# Altium schematic sheet BG95-SHEEET.SchDoc
size C; SheetNumber: 1; SheetTotal: 3
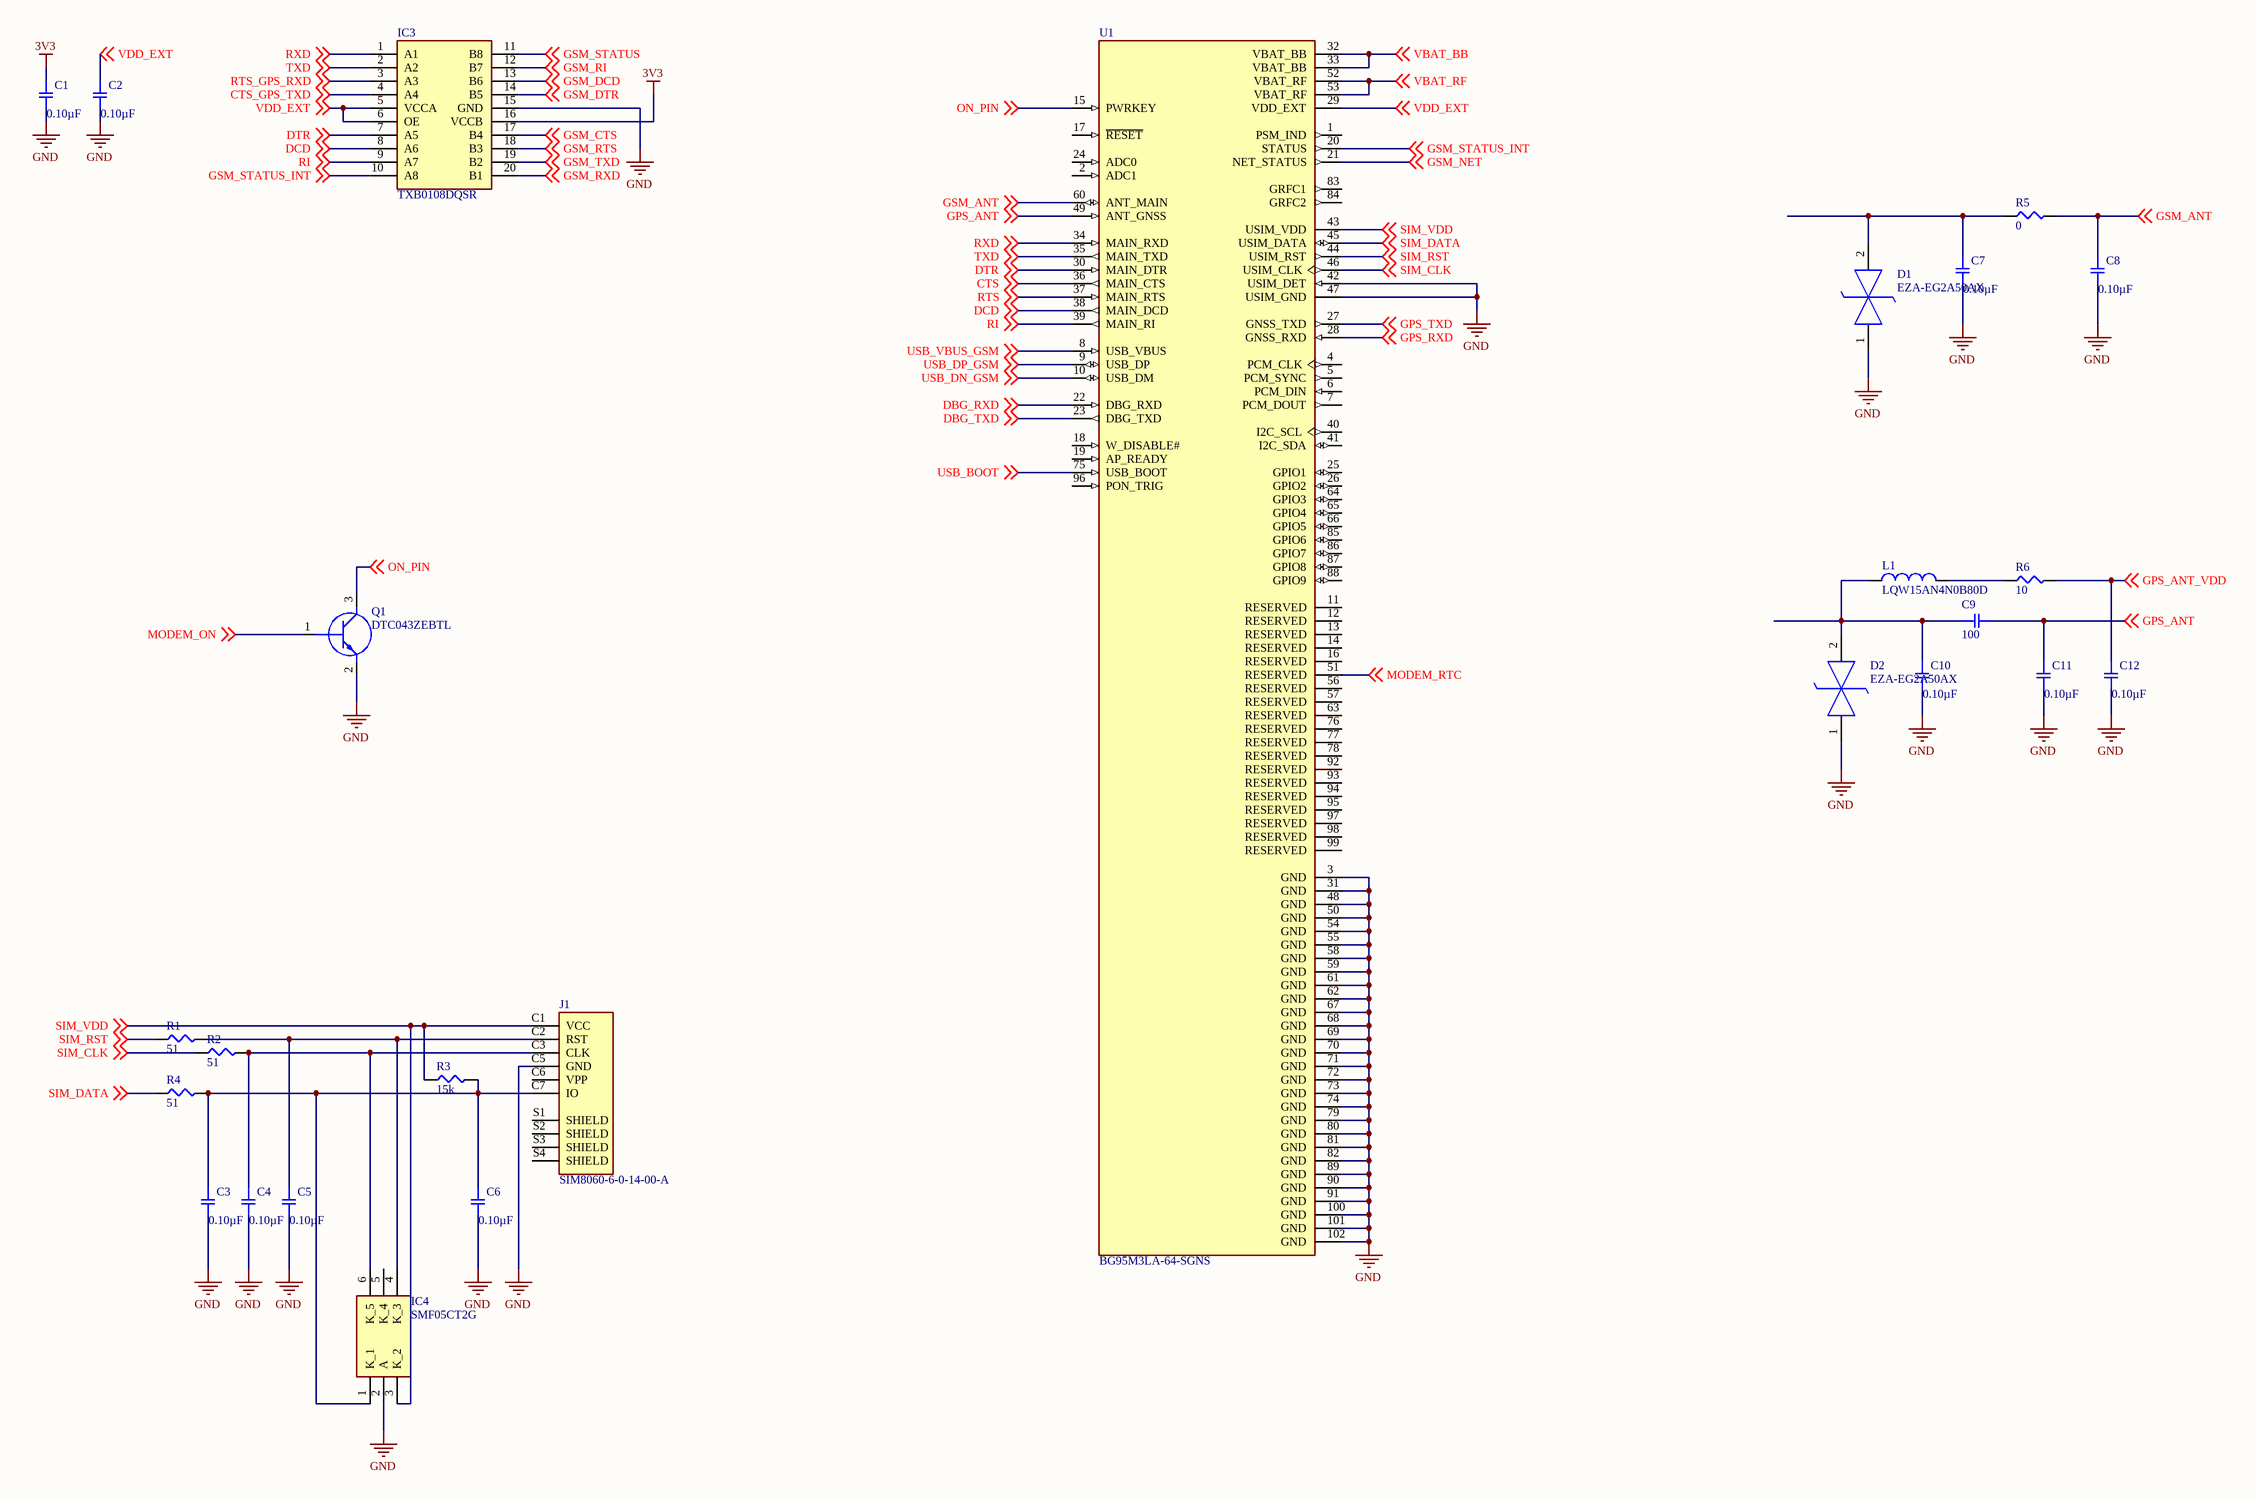
[diagram p0: BG95-SHEEET.SchDoc]

## Parts
C1  0.10µF  [SMD-0402C]
C2  0.10µF  [SMD-0402C]
C3  0.10µF  [SMD-0402C]
C4  0.10µF  [SMD-0402C]
C5  0.10µF  [SMD-0402C]
C6  0.10µF  [SMD-0402C]
C7  0.10µF  [SMD-0402C]
C8  0.10µF  [SMD-0402C]
C9  100  [SMD-0402C]
C10  0.10µF  [SMD-0402C]
C11  0.10µF  [SMD-0402C]
C12  0.10µF  [SMD-0402C]
D1  EZA-EG2A50AX  [EZAEG2A50AX]
D2  EZA-EG2A50AX  [EZAEG2A50AX]
IC3  TXB0108DQSR  [TXB0108DQSR]
IC4  SMF05CT2G  [SOT65P210X110-6N]
J1  SIM8060-6-0-14-00-A  [GCT_SIM8060-6-0-14-00-A]
L1  LQW15AN4N0B80D  [INDC1006X60N]
Q1  DTC043ZEBTL  [SOTFL50P160X85-3N]
R1  51  [SMD-0402-RES]
R2  51  [SMD-0402-RES]
R3  15k  [SMD-0402-RES]
R4  51  [SMD-0402-RES]
R5  0  [SMD-0402-RES]
R6  10  [SMD-0402-RES]
U1  BG95M3LA-64-SGNS  [XCVR_BG95M3LA-64-SGNS]

## Nets
3V3: C1.1 IC3.16(VCCB)
GND: C1.2 C2.2 C3.2 C4.2 C5.2 C6.2 C7.2 C8.2 C10.2 C11.2 C12.2 D1.1(K1) D2.1(K1) IC3.15(GND) IC4.2(A) J1.C5(GND) Q1.2(E) U1.3(GND) U1.31(GND) U1.42(USIM_DET) U1.47(USIM_GND) U1.48(GND) U1.50(GND) U1.54(GND) U1.55(GND) U1.58(GND) U1.59(GND) U1.61(GND) U1.62(GND) U1.67(GND) U1.68(GND) U1.69(GND) U1.70(GND) U1.71(GND) U1.72(GND) U1.73(GND) U1.74(GND) U1.79(GND) U1.80(GND) U1.81(GND) U1.82(GND) U1.89(GND) U1.90(GND) U1.91(GND) U1.100(GND) U1.101(GND) U1.102(GND)
CTS: U1.36(MAIN_CTS) ; off-sheet CTS
CTS_GPS_TXD: IC3.4(A4) ; off-sheet CTS_GPS_TXD
DBG_RXD: U1.22(DBG_RXD) ; off-sheet DBG_RXD
DBG_TXD: U1.23(DBG_TXD) ; off-sheet DBG_TXD
DCD: IC3.8(A6) U1.38(MAIN_DCD) ; off-sheet DCD
DTR: IC3.7(A5) U1.30(MAIN_DTR) ; off-sheet DTR
GPS_ANT: C9.2 C11.1 U1.49(ANT_GNSS) ; off-sheet GPS_ANT
GPS_ANT_VDD: C12.1 R6.2 ; off-sheet GPS_ANT_VDD
GPS_RXD: U1.28(GNSS_RXD) ; off-sheet GPS_RXD
GPS_TXD: U1.27(GNSS_TXD) ; off-sheet GPS_TXD
GSM_ANT: C8.1 R5.2 U1.60(ANT_MAIN) ; off-sheet GSM_ANT
GSM_CTS: IC3.17(B4) ; off-sheet GSM_CTS
GSM_DCD: IC3.13(B6) ; off-sheet GSM_DCD
GSM_DTR: IC3.14(B5) ; off-sheet GSM_DTR
GSM_NET: U1.21(NET_STATUS) ; off-sheet GSM_NET
GSM_RI: IC3.12(B7) ; off-sheet GSM_RI
GSM_RTS: IC3.18(B3) ; off-sheet GSM_RTS
GSM_RXD: IC3.20(B1) ; off-sheet GSM_RXD
GSM_STATUS: IC3.11(B8) ; off-sheet GSM_STATUS
GSM_STATUS_INT: IC3.10(A8) U1.20(STATUS) ; off-sheet GSM_STATUS_INT
GSM_TXD: IC3.19(B2) ; off-sheet GSM_TXD
MODEM_ON: Q1.1(B) ; off-sheet MODEM_ON
MODEM_RTC: U1.51(RESERVED) ; off-sheet MODEM_RTC
ON_PIN: Q1.3(C) U1.15(PWRKEY) ; off-sheet ON_PIN
RI: IC3.9(A7) U1.39(MAIN_RI) ; off-sheet RI
RTS: U1.37(MAIN_RTS) ; off-sheet RTS
RTS_GPS_RXD: IC3.3(A3) ; off-sheet RTS_GPS_RXD
RXD: IC3.1(A1) U1.34(MAIN_RXD) ; off-sheet RXD
SIM_CLK: R2.1 U1.46(USIM_CLK) ; off-sheet SIM_CLK
SIM_DATA: R4.1 U1.45(USIM_DATA) ; off-sheet SIM_DATA
SIM_RST: R1.1 U1.44(USIM_RST) ; off-sheet SIM_RST
SIM_VDD: IC4.3(K_2) J1.C1(VCC) R3.1 U1.43(USIM_VDD) ; off-sheet SIM_VDD
TXD: IC3.2(A2) U1.35(MAIN_TXD) ; off-sheet TXD
USB_BOOT: U1.75(USB_BOOT) ; off-sheet USB_BOOT
USB_DN_GSM: U1.10(USB_DM) ; off-sheet USB_DN_GSM
USB_DP_GSM: U1.9(USB_DP) ; off-sheet USB_DP_GSM
USB_VBUS_GSM: U1.8(USB_VBUS) ; off-sheet USB_VBUS_GSM
VBAT_BB: U1.32(VBAT_BB) U1.33(VBAT_BB) ; off-sheet VBAT_BB
VBAT_RF: U1.52(VBAT_RF) U1.53(VBAT_RF) ; off-sheet VBAT_RF
VDD_EXT: C2.1 IC3.5(VCCA) IC3.6(OE) U1.29(VDD_EXT) ; off-sheet VDD_EXT
NetC3_1: C3.1 C6.1 IC4.1(K_1) J1.C7(IO) R3.2 R4.2
NetC4_1: C4.1 IC4.6(K_5) J1.C3(CLK) R2.2
NetC5_1: C5.1 IC4.4(K_3) J1.C2(RST) R1.2
NetC7_1: C7.1 D1.2(K2) R5.1
NetC9_1: C9.1 C10.1 D2.2(K2) L1.1
NetL1_2: L1.2 R6.1

Not connected (* = marked no-connect by the designer): IC4 5(K_4); J1 C6(VPP) S1(SHIELD) S2(SHIELD) S3(SHIELD) S4(SHIELD); U1 1(PSM_IND) 2(ADC1) 4(PCM_CLK) 5(PCM_SYNC) 6(PCM_DIN) 7(PCM_DOUT) 11(RESERVED) 12(RESERVED) 13(RESERVED) 14(RESERVED) 16(RESERVED) 17(~{RESET}) 18(W_DISABLE#) 19(AP_READY) 24(ADC0) 25(GPIO1) 26(GPIO2) 40(I2C_SCL) 41(I2C_SDA) 56(RESERVED) 57(RESERVED) 63(RESERVED) 64(GPIO3) 65(GPIO4) 66(GPIO5) 76(RESERVED) 77(RESERVED) 78(RESERVED) 83(GRFC1) 84(GRFC2) 85(GPIO6) 86(GPIO7) 87(GPIO8) 88(GPIO9) 92(RESERVED) 93(RESERVED) 94(RESERVED) 95(RESERVED) 96(PON_TRIG) 97(RESERVED) 98(RESERVED) 99(RESERVED)

## Library data of the parts
C1-C8 C10-C12 = GRM152R61A104KE19D: CAP CER 0.1UF 10V X5R 0402; Manufacturer: Murata Electronics North America; Factory Stock: 0; Unit Price (USD): 0.16; Minimum Quantity: 1; Tolerance: ±10%; Datasheets: http://www.murata.com/~/media/webrenewal/support/library/catalog/products/capacitor/mlcc/c02e.pdf; Image: //media.digikey.com/Renders/Murata%20Renders/ZRB-SERIES-0402.jpg; Digi-Key Part Number: 490-10008-1-ND; Part Number: GRM152R61A104KE19D; Quantity Available: 80241; @ qty: 0; Packaging: Cut Tape (CT); Series: GRM; Part Status: Active; Value: 0.10µF; Voltage: 10V; Temperature Coefficient: X5R; Operating Temperature: -55°C ~ 85°C; Features: Derating Recommended; Ratings: -; Applications: General Purpose; Mounting Type: Surface Mount, MLCC; Package / Case: 0402 (1005 Metric); Size / Dimension: 0.039" L x 0.020" W (1.00mm x 0.50mm); Height - Seated (Max): -; Thickness (Max): 0.009" (0.22mm); Lead Spacing: -; Lead Style: -
C9 = GRM152R61A104KE19D: CAP CER 0.1UF 10V X5R 0402; Manufacturer: Murata Electronics North America; Factory Stock: 0; Unit Price (USD): 0.16; Minimum Quantity: 1; Value: 0.10µF; Tolerance: ±10%; Datasheets: http://www.murata.com/~/media/webrenewal/support/library/catalog/products/capacitor/mlcc/c02e.pdf; Image: //media.digikey.com/Renders/Murata%20Renders/ZRB-SERIES-0402.jpg; Digi-Key Part Number: 490-10008-1-ND; Part Number: GRM152R61A104KE19D; Quantity Available: 80241; @ qty: 0; Packaging: Cut Tape (CT); Series: GRM; Part Status: Active; Voltage: 10V; Temperature Coefficient: X5R; Operating Temperature: -55°C ~ 85°C; Features: Derating Recommended; Ratings: -; Applications: General Purpose; Mounting Type: Surface Mount, MLCC; Package / Case: 0402 (1005 Metric); Size / Dimension: 0.039" L x 0.020" W (1.00mm x 0.50mm); Height - Seated (Max): -; Thickness (Max): 0.009" (0.22mm); Lead Spacing: -; Lead Style: -
D1 D2 = EZA-EG2A50AX: Diode ESD (Bi-directional); Manufacturer_Name: Panasonic; Datasheet Link: https://industrial.panasonic.com/cdbs/www-data/pdf/AWD0000/AWD0000C23.pdf; Height: 0.38mm; Manufacturer_Part_Number: EZA-EG2A50AX; Mouser Part Number: 667-EZA-EG2A50AX; Mouser Price/Stock: https://www.mouser.co.uk/ProductDetail/Panasonic/EZA-EG2A50AX?qs=WwqriLBepZuVGjkTEFYPQg%3D%3D; Arrow Part Number: EZA-EG2A50AX; Arrow Price/Stock: https://www.arrow.com/en/products/eza-eg2a50ax/panasonic; Simulation Data: https://industrial.panasonic.com/content/data/CC/files/EZAEG2A50AX.zip
IC3 = TXB0108DQSR: Integrated Circuit; Manufacturer_Name: Texas Instruments; Datasheet Link: http://www.ti.com/lit/gpn/txb0108; Height: 0mm; Manufacturer_Part_Number: TXB0108DQSR; Mouser Part Number: 595-TXB0108DQSR; Mouser Price/Stock: https://www.mouser.co.uk/ProductDetail/Texas-Instruments/TXB0108DQSR?qs=EuM%2FBx4ov4SMZCOlCh%2FWxA%3D%3D; Arrow Part Number: TXB0108DQSR; Arrow Price/Stock: https://www.arrow.com/en/products/txb0108dqsr/texas-instruments?region=nac
IC4 = SMF05CT2G: Integrated Circuit; Manufacturer_Name: onsemi; Datasheet Link: http://www.onsemi.com/pub/Collateral/SMF05C-D.PDF; Height: 1.1mm; Manufacturer_Part_Number: SMF05CT2G; Mouser Part Number: 863-SMF05CT2G; Mouser Price/Stock: https://www.mouser.co.uk/ProductDetail/onsemi/SMF05CT2G?qs=xZq1yRCsb1fkTB9yOMghAg%3D%3D; Arrow Part Number: SMF05CT2G; Arrow Price/Stock: https://www.arrow.com/en/products/smf05ct2g/on-semiconductor?region=nac
J1 = SIM8060-6-0-14-00-A: SIM8060 is a hinged Sim Card Connector. With 6 contacts, with switch for card detection. Profile above PCB is 1.43mm.; MF: {'manufacturer': u'Global Connector Technology'}; Package: None; Price: None; Value: *; MP: SIM8060-6-0-14-00-A; Availability: Unavailable
L1 = LQW15AN4N0B80D: Ind RF Chip Unshielded Wirewound 4nH 0.1nH 100MHz 30Q-Factor 1950mA 0402 Paper T/R; MF: {'manufacturer': u'Murata'}; Package: None; Price: None; Value: *; MP: LQW15AN4N0B80D; Availability: Unavailable
Q1 = DTC043ZEBTL: Transistor BJT NPN; Manufacturer_Name: ROHM Semiconductor; Datasheet Link: http://rohmfs.rohm.com/en/products/databook/datasheet/discrete/transistor/digital/dtc043zmt2l-e.pdf; Height: 0.85mm; Manufacturer_Part_Number: DTC043ZEBTL; Mouser Part Number: 755-DTC043ZEBTL; Mouser Price/Stock: https://www.mouser.co.uk/ProductDetail/ROHM-Semiconductor/DTC043ZEBTL?qs=n7vHx8wJlDGyWrBOh0icRQ%3D%3D
R1 R2 R4 = ERJ-2GEJ510X: RES SMD 51 OHM 5% 1/10W 0402; Manufacturer: Panasonic Electronic Components; Factory Stock: 0; Unit Price (USD): 0.00350; @ qty: 1500; Minimum Quantity: 1; Power (Watts): 0.1W, 1/10W; Temperature Coefficient: ±200ppm/°C; Part Number: ERJ-2GEJ510X; Datasheets: http://industrial.panasonic.com/www-cgi/jvcr13pz.cgi?E+PZ+3+AOA0001+ERJ2GEJ510X+7+WW; Image: //media.digikey.com/Photos/Panasonic%20Photos/ERJ-PA2-Series.jpg; Digi-Key Part Number: P51JCT-ND; Quantity Available: 159188; Packaging: Cut Tape (CT); Series: ERJ; Part Status: Active; Value: 51; Tolerance: ±5%; Composition: Thick Film; Features: Automotive AEC-Q200; Operating Temperature: -55°C ~ 155°C; Package / Case: 0402 (1005 Metric); Supplier Device Package: 0402; Size / Dimension: 0.039" L x 0.020" W (1.00mm x 0.50mm); Height - Seated (Max): 0.016" (0.40mm); Number of Terminations: 2; Failure Rate: -
R3 = ERJ-2GEJ153X: RES SMD 15K OHM 5% 1/10W 0402; Manufacturer: Panasonic Electronic Components; Factory Stock: 0; Unit Price (USD): 0.00350; @ qty: 1500; Minimum Quantity: 1; Power (Watts): 0.1W, 1/10W; Temperature Coefficient: ±200ppm/°C; Part Number: ERJ-2GEJ153X; Datasheets: http://industrial.panasonic.com/www-cgi/jvcr13pz.cgi?E+PZ+3+AOA0001+ERJ2GEJ153X+7+WW; Image: //media.digikey.com/Photos/Panasonic%20Photos/ERJ-PA2-Series.jpg; Digi-Key Part Number: P15KJCT-ND; Quantity Available: 331812; Packaging: Cut Tape (CT); Series: ERJ; Part Status: Active; Value: 15k; Tolerance: ±5%; Composition: Thick Film; Features: Automotive AEC-Q200; Operating Temperature: -55°C ~ 155°C; Package / Case: 0402 (1005 Metric); Supplier Device Package: 0402; Size / Dimension: 0.039" L x 0.020" W (1.00mm x 0.50mm); Height - Seated (Max): 0.016" (0.40mm); Number of Terminations: 2; Failure Rate: -
R5 = ERJ-2GEJ100X: RES SMD 10 OHM 5% 1/10W 0402; Manufacturer: Panasonic Electronic Components; Unit Price (USD): 0.00350; @ qty: 1500; Minimum Quantity: 1; Value: 10; Power (Watts): 0.1W, 1/10W; Temperature Coefficient: ±200ppm/°C; Part Number: ERJ-2GEJ100X; Datasheets: http://industrial.panasonic.com/www-cgi/jvcr13pz.cgi?E+PZ+3+AOA0001+ERJ2GEJ100X+7+WW; Image: //media.digikey.com/Photos/Panasonic%20Photos/ERJ-PA2-Series.jpg; Digi-Key Part Number: P10JCT-ND; Quantity Available: 1054751; Factory Stock: 0; Packaging: Cut Tape (CT); Series: ERJ; Part Status: Active; Tolerance: ±5%; Composition: Thick Film; Features: Automotive AEC-Q200; Operating Temperature: -55°C ~ 155°C; Package / Case: 0402 (1005 Metric); Supplier Device Package: 0402; Size / Dimension: 0.039" L x 0.020" W (1.00mm x 0.50mm); Height - Seated (Max): 0.016" (0.40mm); Number of Terminations: 2; Failure Rate: -
R6 = ERJ-2GEJ100X: RES SMD 10 OHM 5% 1/10W 0402; Manufacturer: Panasonic Electronic Components; Factory Stock: 0; Unit Price (USD): 0.00350; @ qty: 1500; Minimum Quantity: 1; Power (Watts): 0.1W, 1/10W; Temperature Coefficient: ±200ppm/°C; Part Number: ERJ-2GEJ100X; Datasheets: http://industrial.panasonic.com/www-cgi/jvcr13pz.cgi?E+PZ+3+AOA0001+ERJ2GEJ100X+7+WW; Image: //media.digikey.com/Photos/Panasonic%20Photos/ERJ-PA2-Series.jpg; Digi-Key Part Number: P10JCT-ND; Quantity Available: 1054751; Packaging: Cut Tape (CT); Series: ERJ; Part Status: Active; Value: 10; Tolerance: ±5%; Composition: Thick Film; Features: Automotive AEC-Q200; Operating Temperature: -55°C ~ 155°C; Package / Case: 0402 (1005 Metric); Supplier Device Package: 0402; Size / Dimension: 0.039" L x 0.020" W (1.00mm x 0.50mm); Height - Seated (Max): 0.016" (0.40mm); Number of Terminations: 2; Failure Rate: -
U1 = BG95M3LA-64-SGNS: Quectel Bg95 Lte Cat M1/Cat Nb2/Egprs Module    <a href="https://pricing.snapeda.com/parts/BG95M3LA-64-SGNS/Quectel%20Wireless%20Solutions%20Co.%2C%20Ltd/view-part?ref=eda">Check prices</a> <a href="https://pricing.snapeda.com/parts/BG95M3LA-64-SGNS/Quectel%20Wireless%20Solutions%20Co.%2C%20Ltd/view-part?ref=eda">Check prices</a>; MF: {'manufacturer': u'Quectel Wireless Solutions Co., Ltd'}; Package: None; Price: None; Value: *; MP: BG95M3LA-64-SGNS; Availability: Unavailable